# EAGLE design PQS42019.5 v1 (EAGLE 9.3.2)
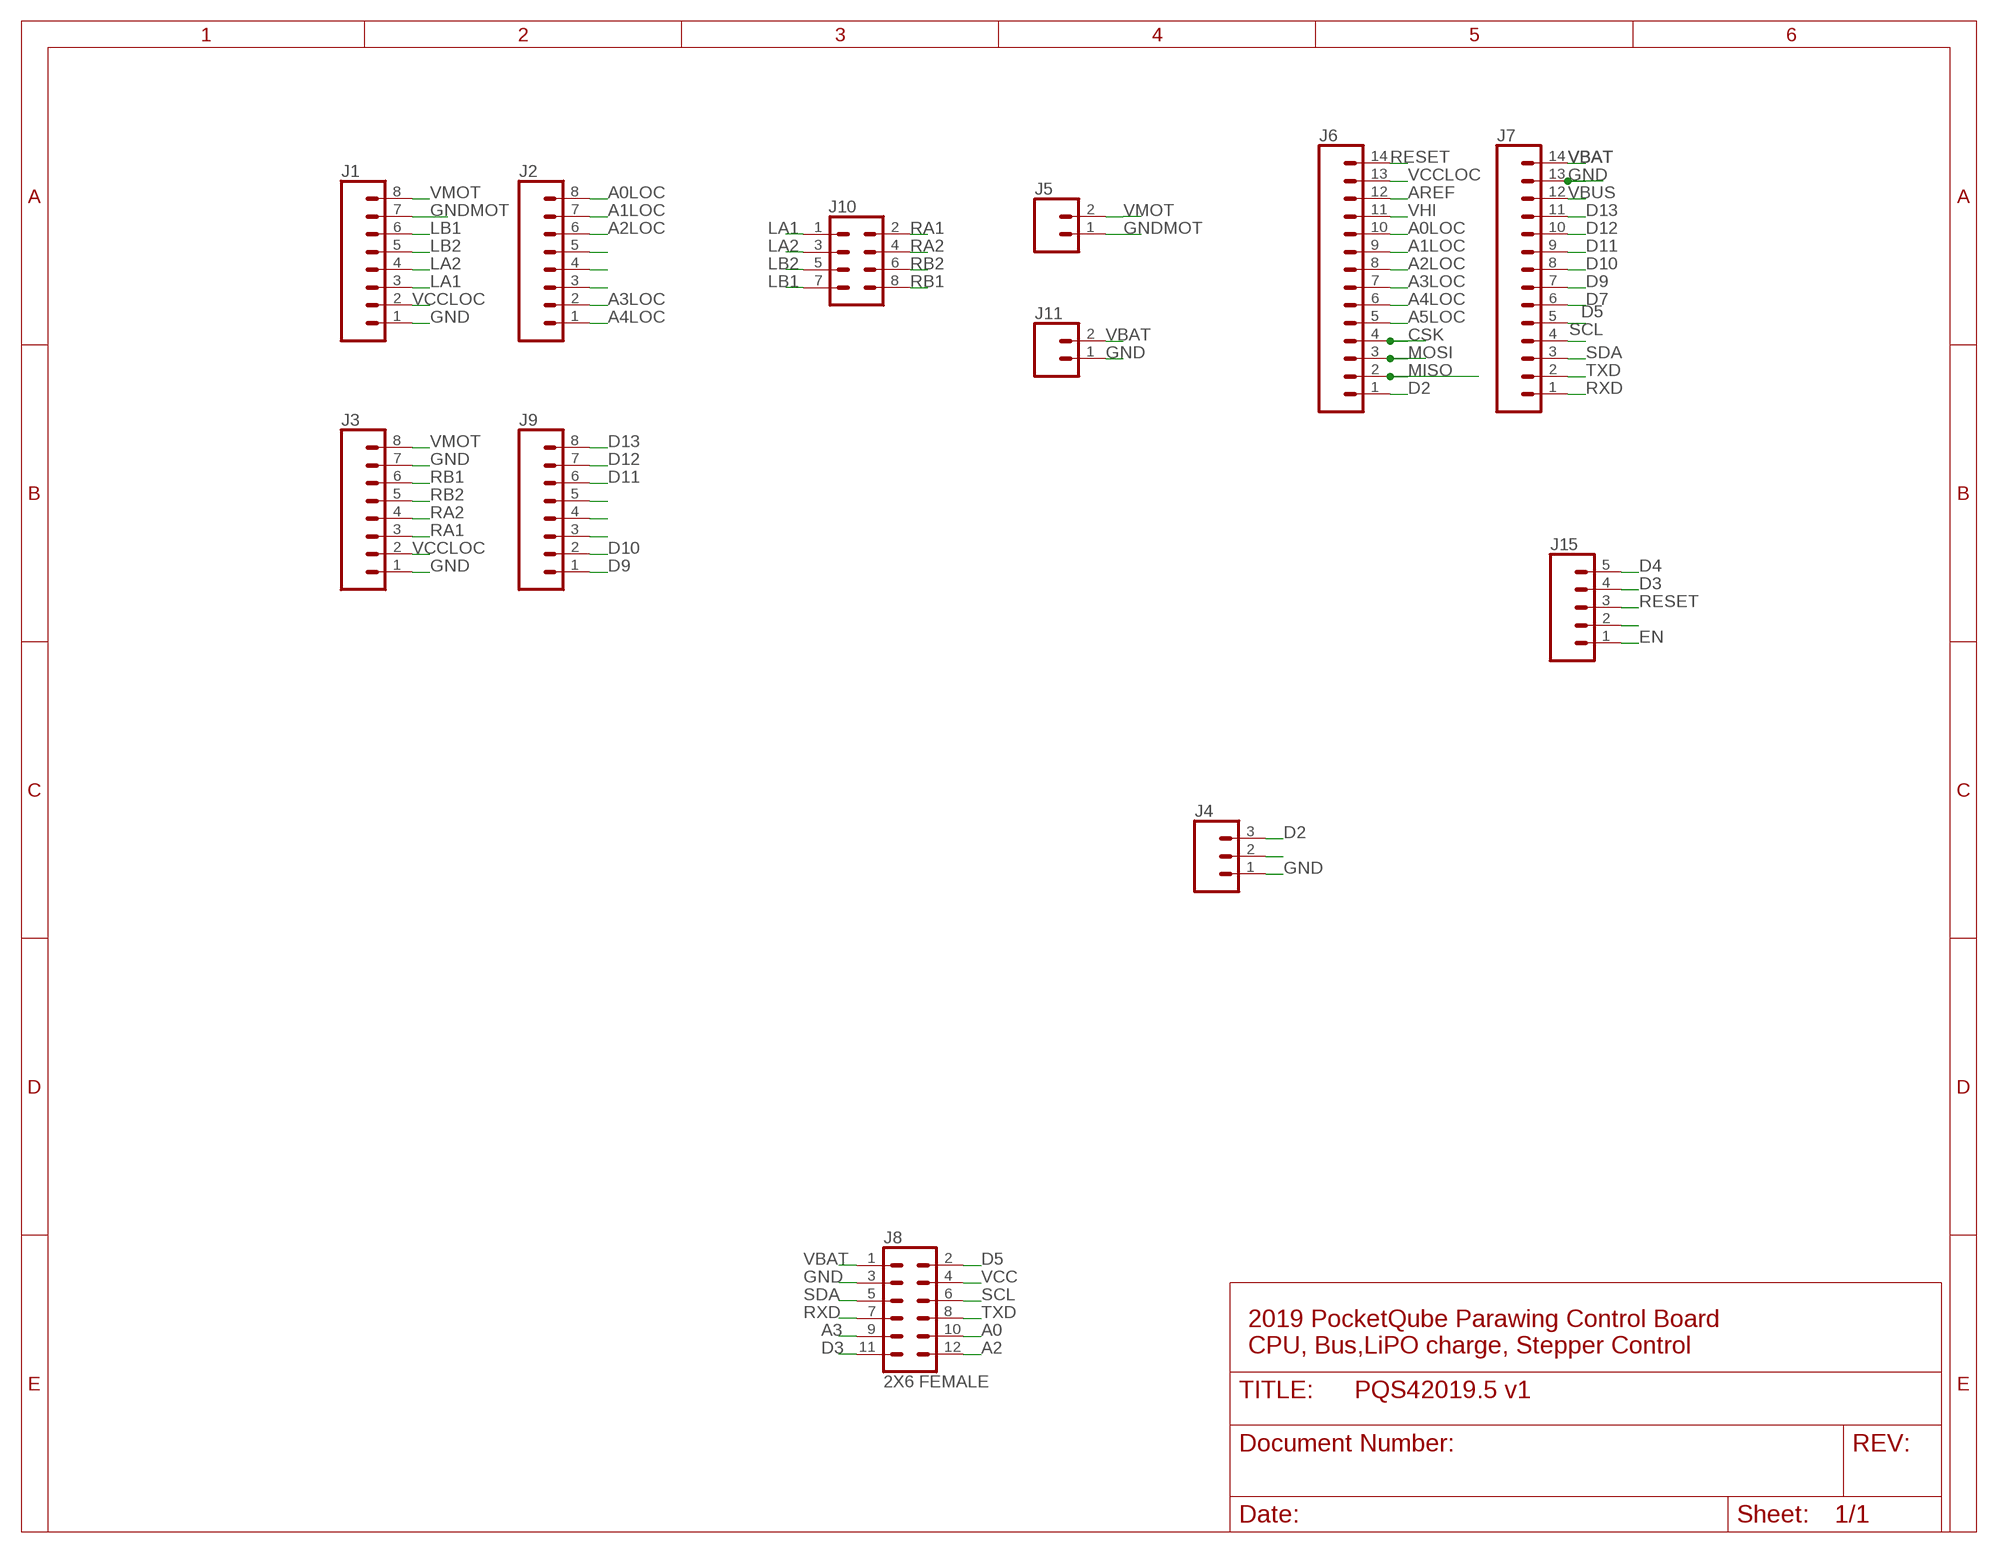
[diagram p0: schematic, sheet 1]

## Parts
J1  CONN_08"  [1X08]
J2  CONN_08"  [1X08]
J3  CONN_08"  [1X08]
J4  CONN_03  [1X03]
J5  CONN_02  [1X02]
J6  CONN_14  [1X14]
J7  CONN_14  [1X14]
J8  2X6 FEMALE  CONN_06X2PTH_FEMALE  [2X6]
J9  CONN_08"  [1X08]
J10  CONN_04X2  [2X4]
J11  CONN_02  [1X02]
J15  CONN_05  [1X05]

## Nets
A0: J8.10
A0LOC: J2.8 J6.10
A1LOC: J2.7 J6.9
A2: J8.12
A2LOC: J2.6 J6.8
A3: J8.9
A3LOC: J2.2 J6.7
A4LOC: J2.1 J6.6
A5LOC: J6.5
AREF: J6.12
CSK: J6.4
D2: J4.3 J6.1
D3: J8.11 J15.4
D4: J15.5
D5: J7.5 J8.2
D7: J7.6
D9: J7.7 J9.1
D10: J7.8 J9.2
D11: J7.9 J9.6
D12: J7.10 J9.7
D13: J7.11 J9.8
EN: J15.1
GND [power]: J1.1 J3.1 J3.7 J4.1 J7.13 J8.3 J11.1
GNDMOT: J1.7 J5.1
LA1: J1.3 J10.1
LA2: J1.4 J10.3
LB1: J1.6 J10.7
LB2: J1.5 J10.5
MISO: J6.2
MOSI: J6.3
N$2: J4.2
N$5: J2.5
N$6: J2.4
N$7: J2.3
N$8: J15.2
N$30: J9.5
N$31: J9.4
N$32: J9.3
RA1: J3.3 J10.2
RA2: J3.4 J10.4
RB1: J3.6 J10.8
RB2: J3.5 J10.6
RESET: J6.14 J15.3
RXD: J7.1 J8.7
SCL: J7.4 J8.6
SDA: J7.3 J8.5
TXD: J7.2 J8.8
VBAT [power]: J7.14 J8.1 J11.2
VBUS [power]: J7.12
VCC: J8.4
VCCLOC: J1.2 J3.2 J6.13
VHI: J6.11
VMOT: J1.8 J3.8 J5.2

## Notes on the sheet
- 2019 PocketQube Parawing Control Board
  CPU, Bus,LiPO charge, Stepper Control

## Library data of the parts
J1-J3 J9 = SparkFun-Connectors:CONN_08: Multi connection point. Often used as Generic Header-pin footprint for 0.1 inch spaced/style header connections On any of the 0.1 inch spaced packages, you can populate with these: Break Away Headers - Straight <https://www.sparkfun.com/products/116> (PRT-00116) Break Away Male Headers - Right Angle <https://www.sparkfun.com/products/553> (PRT-00553) Female Headers <https://www.sparkfun.com/products/115> (PRT-00115) Break Away Headers - Machine Pin <https://www.sparkfun.com/products/117> (PRT-00117) Break Away Female Headers - Swiss Machine Pin <https://www.sparkfun.com/products/743> (PRT-00743) Arduino Stackable Header - 8 Pin <https://www.sparkfun.com/products/9279> (PRT-09279) For SCREWTERMINALS and SPRING TERMINALS visit here: Screw Terimnals on SparkFun.com <https://www.sparkfun.com/search/results?term=Screw+Terminals> (5mm/3.5mm/2.54mm spacing) This device is also useful as a general connection point to wire up your design to another part of your project. Our various solder wires solder well into these plated through hole pads. Hook-Up Wire - Assortment (Stranded, 22 AWG) <https://www.sparkfun.com/products/11375> (PRT-11375) Hook-Up Wire - Assortment (Solid Core, 22 AWG) <https://www.sparkfun.com/products/11367> (PRT-11367) View the entire wire category on our website here <https://www.sparkfun.com/categories/141> Special notes: Molex polarized connector foot print use with SKU : PRT-08231 with associated crimp pins and housings. 1MM SMD Version SKU: PRT-10208 NOTES ON THE VARIANTS LOCK and LOCK_LONGPADS... This footprint was designed to help hold the alignment of a through-hole component (i.e. 6-pin header) while soldering it into place. You may notice that each hole has been shifted either up or down by 0.005 of an inch from it's more standard position (which is a perfectly straight line). This slight alteration caused the pins (the squares in the middle) to touch the edges of the holes. Because they are alternating, it causes a "brace" to hold the component in place. 0.005 has proven to be the perfect amount of "off-center" position when using our standard breakaway headers. Although looks a little odd when you look at the bare footprint, once you have a header in there, the alteration is very hard to notice. Also,if you push a header all the way into place, it is covered up entirely on the bottom side.; PROD_ID: CONN-08438
J4 = SparkFun-Connectors:CONN_03: Multi connection point. Often used as Generic Header-pin footprint for 0.1 inch spaced/style header connections On any of the 0.1 inch spaced packages, you can populate with these: Break Away Headers - Straight <https://www.sparkfun.com/products/116> (PRT-00116) Break Away Male Headers - Right Angle <https://www.sparkfun.com/products/553> (PRT-00553) Female Headers <https://www.sparkfun.com/products/115> (PRT-00115) Break Away Headers - Machine Pin <https://www.sparkfun.com/products/117> (PRT-00117) Break Away Female Headers - Swiss Machine Pin <https://www.sparkfun.com/products/743> (PRT-00743) Stackable Header - 3 Pin (Female, 0.1") <https://www.sparkfun.com/products/13875> (PRT-13875) For SCREWTERMINALS and SPRING TERMINALS visit here: Screw Terimnals on SparkFun.com <https://www.sparkfun.com/search/results?term=Screw+Terminals> (5mm/3.5mm/2.54mm spacing) This device is also useful as a general connection point to wire up your design to another part of your project. Our various solder wires solder well into these plated through hole pads. Hook-Up Wire - Assortment (Stranded, 22 AWG) <https://www.sparkfun.com/products/11375> (PRT-11375) Hook-Up Wire - Assortment (Solid Core, 22 AWG) <https://www.sparkfun.com/products/11367> (PRT-11367) View the entire wire category on our website here <https://www.sparkfun.com/categories/141> Special notes: Molex polarized connector foot print use with SKU : PRT-08232 with associated crimp pins and housings.
J5 J11 = SparkFun-Connectors:CONN_02: Multi connection point. Often used as Generic Header-pin footprint for 0.1 inch spaced/style header connections On any of the 0.1 inch spaced packages, you can populate with these: Break Away Headers - Straight <https://www.sparkfun.com/products/116> (PRT-00116) Break Away Male Headers - Right Angle <https://www.sparkfun.com/products/553> (PRT-00553) Female Headers <https://www.sparkfun.com/products/115> (PRT-00115) Break Away Headers - Machine Pin <https://www.sparkfun.com/products/117> (PRT-00117) Break Away Female Headers - Swiss Machine Pin <https://www.sparkfun.com/products/743> (PRT-00743) For SCREWTERMINALS and SPRING TERMINALS visit here: Screw Terimnals on SparkFun.com <https://www.sparkfun.com/search/results?term=Screw+Terminals> (5mm/3.5mm/2.54mm spacing) This device is also useful as a general connection point to wire up your design to another part of your project. Our various solder wires solder well into these plated through hole pads. Hook-Up Wire - Assortment (Stranded, 22 AWG) <https://www.sparkfun.com/products/11375> (PRT-11375) Hook-Up Wire - Assortment (Solid Core, 22 AWG) <https://www.sparkfun.com/products/11367> (PRT-11367) View the entire wire category on our website here <https://www.sparkfun.com/categories/141> Special notes: Molex polarized connector foot print use with: PRT-08233 with associated crimp pins and housings. 2.54_SCREWTERM for use with PRT-10571. 3.5mm Screw Terminal footprints for PRT-08084 5mm Screw Terminal footprints for use with PRT-08432
J6 J7 = SparkFun-Connectors:CONN_14: Multi connection point. Often used as Generic Header-pin footprint for 0.1 inch spaced/style header connections On any of the 0.1 inch spaced packages, you can populate with these: Break Away Headers - Straight <https://www.sparkfun.com/products/116> (PRT-00116) Break Away Male Headers - Right Angle <https://www.sparkfun.com/products/553> (PRT-00553) Female Headers <https://www.sparkfun.com/products/115> (PRT-00115) Break Away Headers - Machine Pin <https://www.sparkfun.com/products/117> (PRT-00117) Break Away Female Headers - Swiss Machine Pin <https://www.sparkfun.com/products/743> (PRT-00743) For SCREWTERMINALS and SPRING TERMINALS visit here: Screw Terimnals on SparkFun.com <https://www.sparkfun.com/search/results?term=Screw+Terminals> (5mm/3.5mm/2.54mm spacing) This device is also useful as a general connection point to wire up your design to another part of your project. Our various solder wires solder well into these plated through hole pads. Hook-Up Wire - Assortment (Stranded, 22 AWG) <https://www.sparkfun.com/products/11375> (PRT-11375) Hook-Up Wire - Assortment (Solid Core, 22 AWG) <https://www.sparkfun.com/products/11367> (PRT-11367) View the entire wire category on our website here <https://www.sparkfun.com/categories/141> Special notes: Molex polarized connector foot print use with SKU : PRT-08231 with associated crimp pins and housings. 1MM SMD Version SKU: PRT-10208 NOTES ON THE VARIANTS LOCK and LOCK_LONGPADS... This footprint was designed to help hold the alignment of a through-hole component (i.e. 6-pin header) while soldering it into place. You may notice that each hole has been shifted either up or down by 0.005 of an inch from it's more standard position (which is a perfectly straight line). This slight alteration caused the pins (the squares in the middle) to touch the edges of the holes. Because they are alternating, it causes a "brace" to hold the component in place. 0.005 has proven to be the perfect amount of "off-center" position when using our standard breakaway headers. Although looks a little odd when you look at the bare footprint, once you have a header in there, the alteration is very hard to notice. Also,if you push a header all the way into place, it is covered up entirely on the bottom side.
J8 = SparkFun-Connectors:CONN_06X2: Multi connection point. Often used as Generic Header-pin footprint for 0.1 inch spaced/style header connections On any of the 0.1 inch spaced packages, you can populate with these: Break Away Headers - Straight <https://www.sparkfun.com/products/116> (PRT-00116) Break Away Male Headers - Right Angle <https://www.sparkfun.com/products/553> (PRT-00553) Female Headers <https://www.sparkfun.com/products/115> (PRT-00115) Break Away Headers - Machine Pin <https://www.sparkfun.com/products/117> (PRT-00117) Break Away Female Headers - Swiss Machine Pin <https://www.sparkfun.com/products/743> (PRT-00743); PROD_ID: CONN-12423
J10 = SparkFun-Connectors:CONN_04X2: Multi connection point. Often used as Generic Header-pin footprint for 0.1 inch spaced/style header connections On any of the 0.1 inch spaced packages, you can populate with these: Break Away Headers - Straight <https://www.sparkfun.com/products/116> (PRT-00116) Break Away Male Headers - Right Angle <https://www.sparkfun.com/products/553> (PRT-00553) Female Headers <https://www.sparkfun.com/products/115> (PRT-00115) Break Away Headers - Machine Pin <https://www.sparkfun.com/products/117> (PRT-00117) Break Away Female Headers - Swiss Machine Pin <https://www.sparkfun.com/products/743> (PRT-00743)
J15 = SparkFun-Connectors:CONN_05: Multi connection point. Often used as Generic Header-pin footprint for 0.1 inch spaced/style header connections On any of the 0.1 inch spaced packages, you can populate with these: Break Away Headers - Straight <https://www.sparkfun.com/products/116> (PRT-00116) Break Away Male Headers - Right Angle <https://www.sparkfun.com/products/553> (PRT-00553) Female Headers <https://www.sparkfun.com/products/115> (PRT-00115) Break Away Headers - Machine Pin <https://www.sparkfun.com/products/117> (PRT-00117) Break Away Female Headers - Swiss Machine Pin <https://www.sparkfun.com/products/743> (PRT-00743) For SCREWTERMINALS and SPRING TERMINALS visit here: Screw Terimnals on SparkFun.com <https://www.sparkfun.com/search/results?term=Screw+Terminals> (5mm/3.5mm/2.54mm spacing) This device is also useful as a general connection point to wire up your design to another part of your project. Our various solder wires solder well into these plated through hole pads. Hook-Up Wire - Assortment (Stranded, 22 AWG) <https://www.sparkfun.com/products/11375> (PRT-11375) Hook-Up Wire - Assortment (Solid Core, 22 AWG) <https://www.sparkfun.com/products/11367> (PRT-11367) View the entire wire category on our website here <https://www.sparkfun.com/categories/141> Special notes: Molex polarized connector foot print use with SKU : PRT-08231 with associated crimp pins and housings. 1MM SMD Version SKU: PRT-10208

## Net classes
1 power: width 0.305 mm

## Board
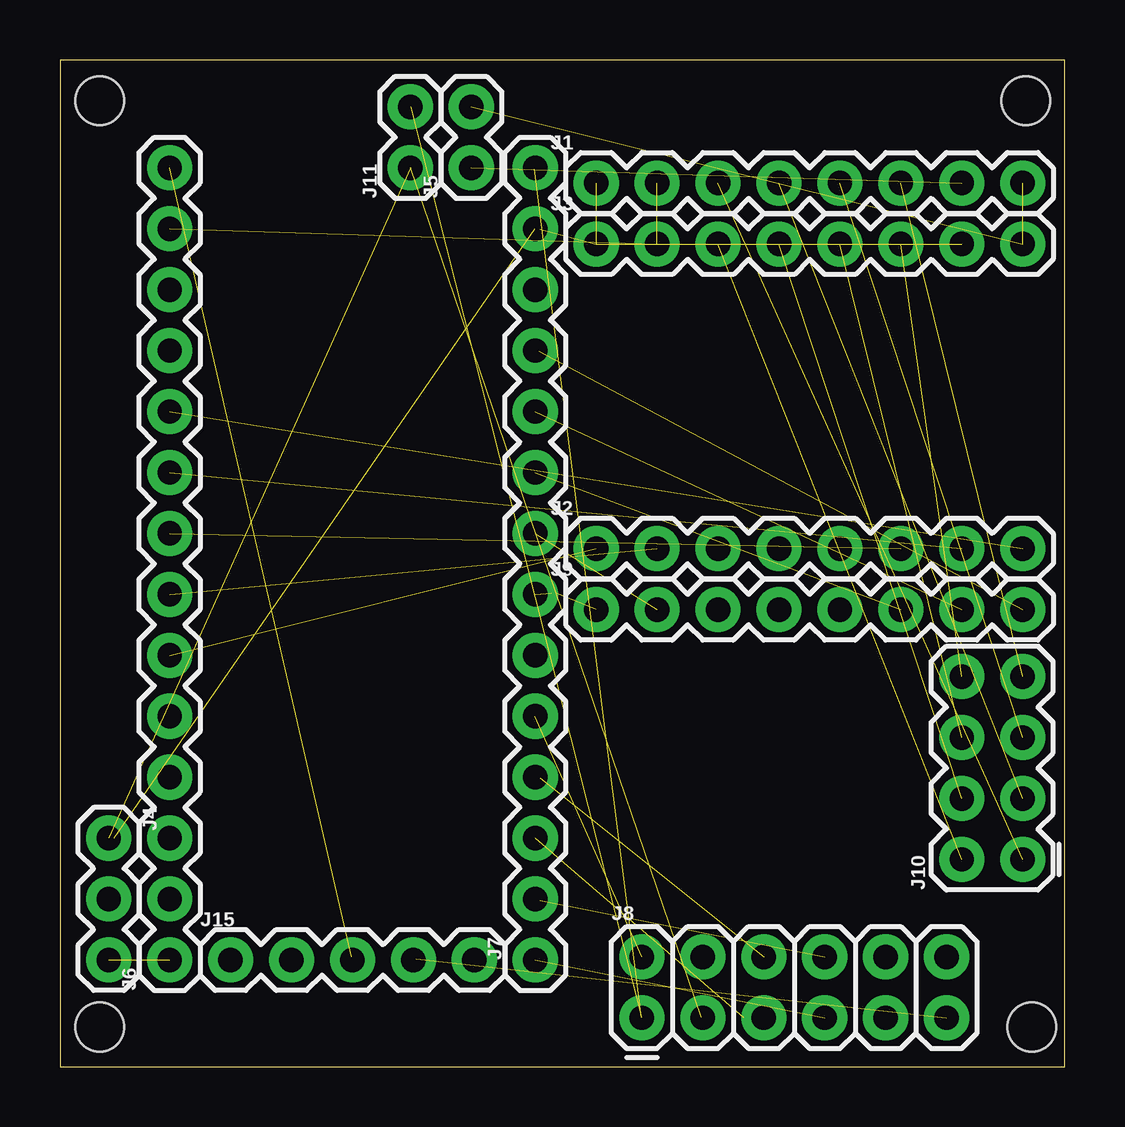
[diagram p1: board, top side]
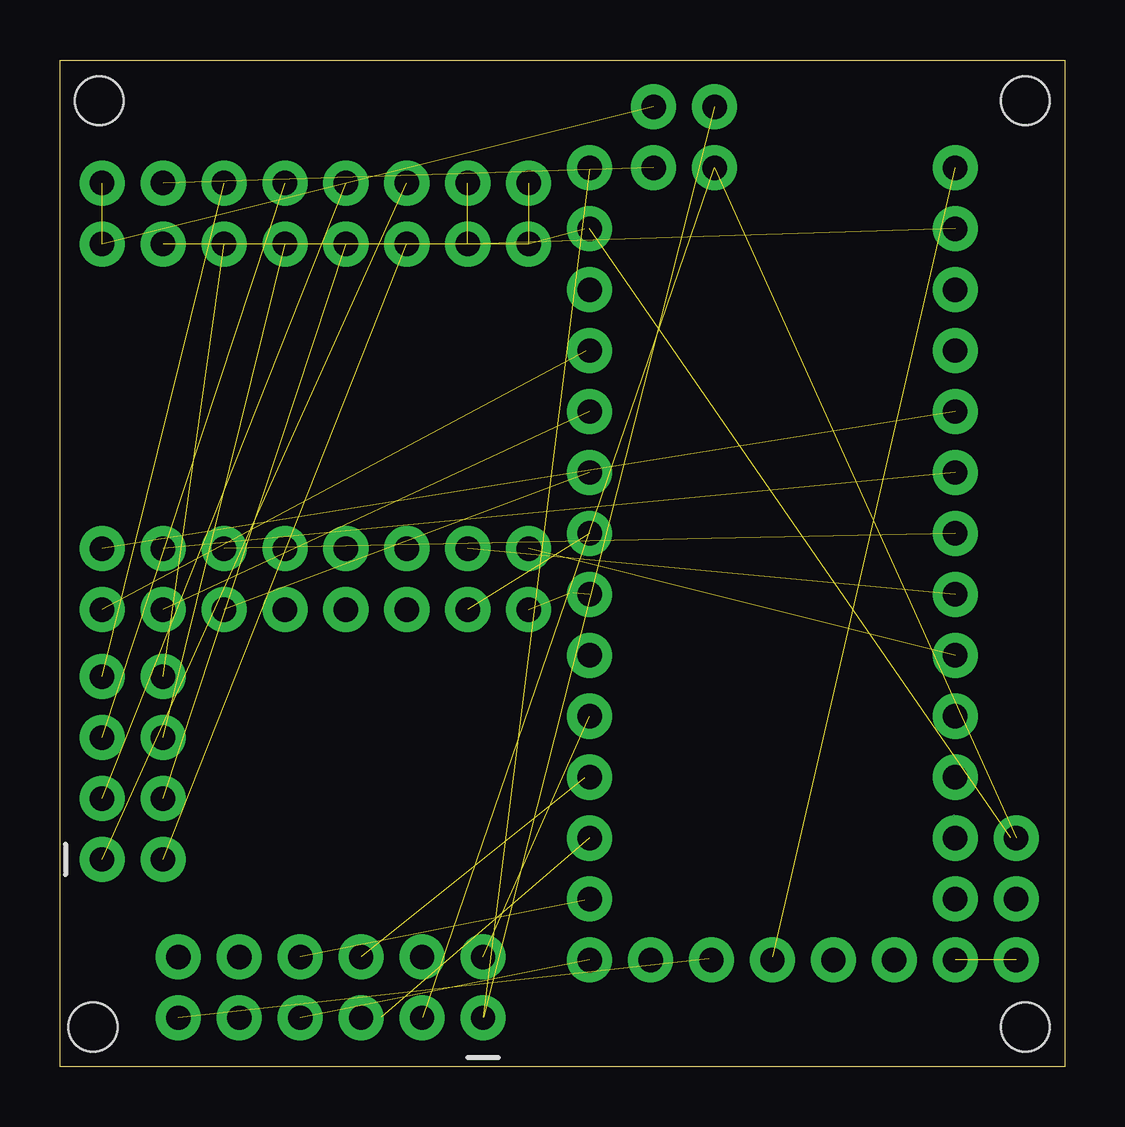
[diagram p2: board, bottom side, seen from below]

Size 41.89 x 41.96 mm. Coordinates in mm from the lower left corner, seen from the top.
Outline: 0,41.96 0,0 41.89,0 41.89,41.96 0,41.96
Copper layers (1*16): Top 0.035mm / dielectric 1.5mm / Bottom 0.035mm
Design rules "default": minimum track width 6mil, minimum drill 0.35mm, track to track 6mil, track to pad 6mil, pad to pad 6mil, via to via 6mil, smd to smd 6mil, copper to edge 40mil, drill to drill 6mil, minimum pad ring 10mil, minimum via ring 8mil, stop-mask expansion 4mil, vias tented up to drill 0mil, thermal gap 10mil
Holes 2.03 mm at 1.65,1.65 40.26,40.26 40.51,1.65 1.65,40.26

### Footprints (pad centres in the part's own frame; a part is rotated, then mirrored left to right if it is on the bottom)
1X08 = drill 1.016 pad 1.88: 1 0,0; 2 2.54,0; 3 5.08,0; 4 7.62,0; 5 10.16,0; 6 12.7,0; 7 15.24,0; 8 17.78,0
1X03 = drill 1.016 pad 1.88: 1 0,0; 2 2.54,0; 3 5.08,0
1X02 = drill 1.016 pad 1.88: 1 0,0; 2 2.54,0
1X14 = drill 1.016 pad 1.88: 1 0,0; 2 2.54,0; 3 5.08,0; 4 7.62,0; 5 10.16,0; 6 12.7,0; 7 15.24,0; 8 17.78,0; 9 20.32,0; 10 22.86,0; 11 25.4,0; 12 27.94,0; 13 30.48,0; 14 33.02,0
2X6 = drill 1.016 pad 1.88: 1 0,0; 2 0,2.54; 3 2.54,0; 4 2.54,2.54; 5 5.08,0; 6 5.08,2.54; 7 7.62,0; 8 7.62,2.54; 9 10.16,0; 10 10.16,2.54; 11 12.7,0; 12 12.7,2.54
2X4 = drill 1.016 pad 1.88: 1 -3.81,-1.27; 2 -3.81,1.27; 3 -1.27,-1.27; 4 -1.27,1.27; 5 1.27,-1.27; 6 1.27,1.27; 7 3.81,-1.27; 8 3.81,1.27
1X05 = drill 1.016 pad 1.88: 1 0,0; 2 2.54,0; 3 5.08,0; 4 7.62,0; 5 10.16,0

### Placement (x,y rotation side)
J1  22.35,36.83 0 top
J2  22.35,21.59 0 top
J3  22.35,34.29 0 top
J4  2.03,9.53 270 top
J5  17.14,37.47 90 top
J6  4.57,4.45 90 top
J7  19.81,4.45 90 top
J8  24.26,2.03 0 top
J9  22.35,19.05 0 top
J10  38.86,12.45 90 top
J11  14.61,37.47 90 top
J15  7.11,4.45 0 top

### Tracks (layer width: path | path; a pad name or v marks a point on that pad's centre or on a via)
A0
  Bottom 0.152: 34.39,4.7 J8.10 | 34.39,4.78 J8.10 | 34.44,4.8 J8.10
A0LOC  (1 unrouted)
A1LOC  (1 unrouted)
A2LOC  (1 unrouted)
A3LOC  (1 unrouted)
A4LOC  (1 unrouted)
A5LOC
  Bottom 0.152: 4.57,14.58 J6.5 | 4.62,14.55 J6.5 | 4.62,14.63 J6.5
CSK
  Bottom 0.152: 4.62,12.06 J6.4 | 4.65,11.84 4.65,11.96 4.7,11.96 J6.4 | 4.7,11.81 J6.4 | 4.7,11.73 J6.4
D2  (1 unrouted)
D3  (1 unrouted)
  Bottom 0.152: 14.68,4.45 J15.4 | 14.78,4.45 J15.4 | 14.83,4.5 J15.4 | 14.83,4.57 J15.4 | 14.83,4.65 J15.4
D5  (1 unrouted)
D9  (2 unrouted)
  Bottom 0.152: 19.79,19.66 J7.7 | 20.65,19.74 20.5,19.74
D10  (1 unrouted)
D11  (1 unrouted)
D12  (1 unrouted)
D13  (1 unrouted)
  Bottom 0.152: 19.96,29.82 19.81,29.82 J7.11
GND  (6 unrouted)
  Bottom 0.305: 19.86,34.9 J7.13 20.02,34.9 | 2.26,9.53 J4.1 | 26.75,2.06 J8.3
GNDMOT  (1 unrouted)
LA1  (1 unrouted)
LA2  (1 unrouted)
LB1  (1 unrouted)
LB2  (1 unrouted)
MISO
  Bottom 0.152: 4.62,7.01 J6.2
MOSI
  Bottom 0.152: 4.57,9.32 J6.3 4.62,9.53 4.62,10.44
RA1  (1 unrouted)
RA2  (1 unrouted)
RB1  (1 unrouted)
RB2  (1 unrouted)
RESET  (1 unrouted)
  Bottom 0.152: 12.17,4.5 J15.3 12.17,4.57
RXD  (1 unrouted)
SCL  (1 unrouted)
  Bottom 0.152: 19.86,11.89 19.86,12.04 J7.4 | 19.94,12.04 J7.4 | 20.02,12.04 J7.4
SDA  (1 unrouted)
  Bottom 0.152: 29.29,2.03 J8.5 | 29.34,2.06 J8.5 | 28.5,2.06 29.26,2.06 J8.5
TXD  (1 unrouted)
  Bottom 0.152: 19.79,7.04 J7.2 | 19.71,7.04 J7.2 | 19.86,6.96 J7.2 | 19.89,6.96 J7.2 | 19.71,7.09 J7.2 | 19.94,6.93 J7.2 | 20.02,6.93 J7.2
VBAT  (2 unrouted)
  Bottom 0.305: 24.23,2.06 J8.1 | 19.79,37.41 J7.14
VBUS
  Bottom 0.305: J7.12 19.18,32.38
VCCLOC  (2 unrouted)
VMOT  (2 unrouted)